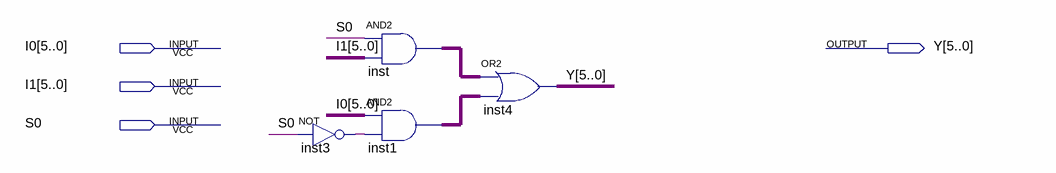
[diagram p0: schematic sheet]
// Quartus schematic MX2_6.bdf as structural Verilog: 4 symbols, 4 pins
module MX2_6 (
  input  [5:0] I0,
  input  [5:0] I1,
  input  S0,
  output [5:0] Y
);

  wire inst3_out;
  wire [5:0] inst1_out, inst_out;

  not inst3 (inst3_out, S0);
  assign inst_out = {6{S0}} & I1;  // AND2 inst, 6 bits wide
  assign inst1_out = I0 & {6{inst3_out}};  // AND2 inst1, 6 bits wide
  assign Y = inst_out | inst1_out;  // OR2 inst4, 6 bits wide
endmodule
